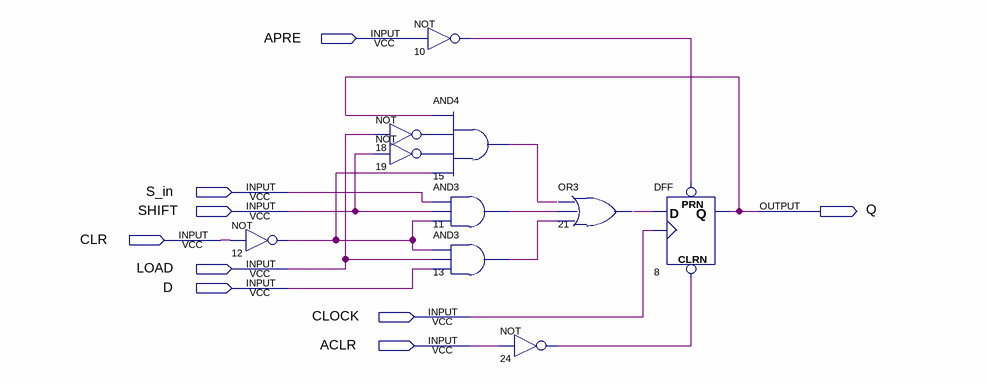
[diagram p0: schematic sheet]
// Quartus schematic 1bitsr.bdf as structural Verilog: 10 symbols, 9 pins
module \1bitsr  (
  input  APRE,
  input  S_in,
  input  SHIFT,
  input  CLR,
  input  LOAD,
  input  D,
  input  CLOCK,
  input  ACLR,
  output Q
);

  wire n10_out, n11_out, n12_out, n13_out, n15_out, n18_out, n19_out, n21_out, n24_out;

  not u_12 (n12_out, CLR);
  not u_10 (n10_out, APRE);
  not u_18 (n18_out, LOAD);
  not u_19 (n19_out, SHIFT);
  and u_15 (n15_out, Q, n18_out, n19_out, n12_out);
  and u_11 (n11_out, S_in, SHIFT, n12_out);
  and u_13 (n13_out, n12_out, LOAD, D);
  or u_21 (n21_out, n15_out, n11_out, n13_out);
  not u_24 (n24_out, ACLR);
  DFF u_8 (.CLRN(n24_out), .CLK(CLOCK), .D(n21_out), .PRN(n10_out), .Q(Q));
endmodule
